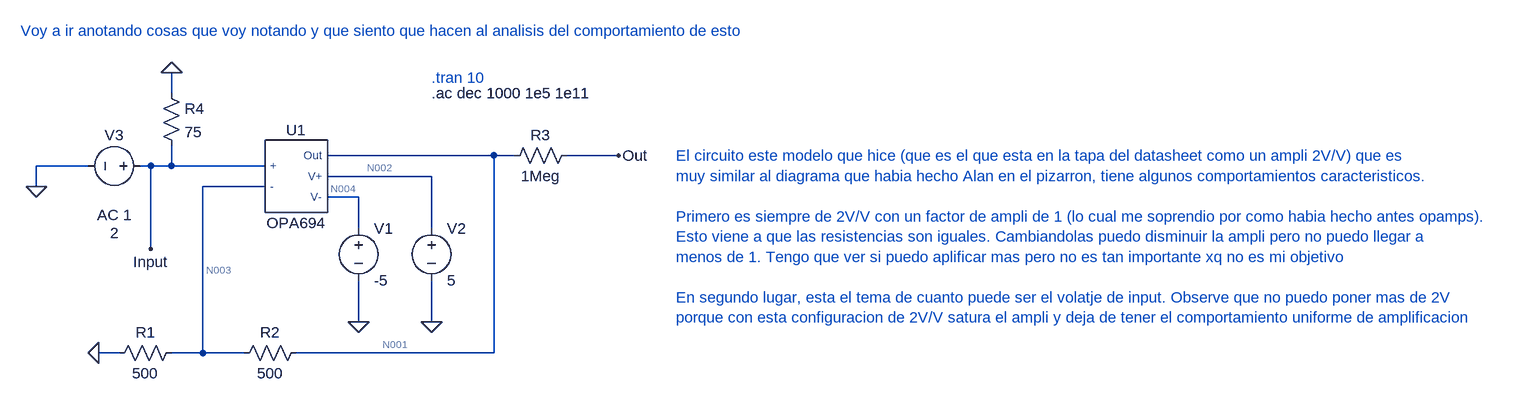
[diagram p0: schematic Draft2.asc]
Draft2.asc, the LTspice schematic file:
Version 4
SHEET 1 2036 680
WIRE -240 -192 -240 -224
WIRE 256 -96 0 -96
WIRE 288 -96 256 -96
WIRE 448 -96 368 -96
WIRE -368 -80 -448 -80
WIRE -272 -80 -288 -80
WIRE -240 -80 -240 -112
WIRE -240 -80 -272 -80
WIRE -96 -80 -240 -80
WIRE 160 -64 0 -64
WIRE -448 -48 -448 -80
WIRE -96 -48 -192 -48
WIRE 48 -32 0 -32
WIRE 48 16 48 -32
WIRE 160 16 160 -64
WIRE -272 48 -272 -80
WIRE 48 160 48 96
WIRE 160 160 160 96
WIRE -320 208 -352 208
WIRE -192 208 -192 -48
WIRE -192 208 -240 208
WIRE -128 208 -192 208
WIRE 256 208 256 -96
WIRE 256 208 -48 208
FLAG 48 160 0
FLAG 160 160 0
FLAG -448 -48 0
FLAG 448 -96 Out
FLAG -352 208 0
FLAG -240 -224 0
FLAG -272 48 Input
SYMBOL AutoGenerated\\OPA694 -48 -64 R0
SYMATTR InstName U1
SYMBOL voltage 48 0 R0
WINDOW 123 0 0 Left 0
WINDOW 39 0 0 Left 0
SYMATTR InstName V1
SYMATTR Value -5
SYMBOL res -224 192 R90
WINDOW 0 0 56 VBottom 2
WINDOW 3 32 56 VTop 2
SYMATTR InstName R1
SYMATTR Value 500
SYMBOL voltage -272 -80 R90
WINDOW 0 -32 56 VBottom 2
WINDOW 3 88 56 VTop 2
WINDOW 123 60 56 VTop 2
WINDOW 39 0 0 Left 0
SYMATTR InstName V3
SYMATTR Value 2
SYMATTR Value2 AC 1
SYMBOL res -144 224 R270
WINDOW 0 32 56 VTop 2
WINDOW 3 0 56 VBottom 2
SYMATTR InstName R2
SYMATTR Value 500
SYMBOL res 272 -80 R270
WINDOW 0 32 56 VTop 2
WINDOW 3 0 56 VBottom 2
SYMATTR InstName R3
SYMATTR Value 1Meg
SYMBOL voltage 160 0 R0
WINDOW 123 0 0 Left 0
WINDOW 39 0 0 Left 0
SYMATTR InstName V2
SYMATTR Value 5
SYMBOL res -256 -208 R0
SYMATTR InstName R4
SYMATTR Value 75
TEXT 160 -192 Left 2 !.ac dec 1000 1e5 1e11
TEXT 160 -216 Left 2 ;.tran 10
TEXT -472 -288 Left 2 ;Voy a ir anotando cosas que voy notando y que siento que hacen al analisis del comportamiento de esto
TEXT 536 -96 Left 2 ;El circuito este modelo que hice (que es el que esta en la tapa del datasheet como un ampli 2V/V) que es \nmuy similar al diagrama que habia hecho Alan en el pizarron, tiene algunos comportamientos caracteristicos.\n \nPrimero es siempre de 2V/V con un factor de ampli de 1 (lo cual me soprendio por como habia hecho antes opamps). \nEsto viene a que las resistencias son iguales. Cambiandolas puedo disminuir la ampli pero no puedo llegar a\nmenos de 1. Tengo que ver si puedo aplificar mas pero no es tan importante xq no es mi objetivo\n \nEn segundo lugar, esta el tema de cuanto puede ser el volatje de input. Observe que no puedo poner mas de 2V\nporque con esta configuracion de 2V/V satura el ampli y deja de tener el comportamiento uniforme de amplificacion

The netlist it stands for:
* Draft2.asc
XU1 Input N003 N001 N002 N004 OPA694  ; pins + - Out V+ V-
V1 N004 0 -5
R1 N003 0 500
V3 Input 0 2 AC 1
R2 N003 N001 500
R3 N001 Out 1Meg
V2 N002 0 5
R4 0 Input 75
.ac dec 1000 1e5 1e11
* .tran 10
* Voy a ir anotando cosas que voy notando y que siento que hacen al analisis del comportamiento de esto
* El circuito este modelo que hice (que es el que esta en la tapa del datasheet como un ampli 2V/V) que es
* muy similar al diagrama que habia hecho Alan en el pizarron, tiene algunos comportamientos caracteristicos.
* Primero es siempre de 2V/V con un factor de ampli de 1 (lo cual me soprendio por como habia hecho antes opamps).
* Esto viene a que las resistencias son iguales. Cambiandolas puedo disminuir la ampli pero no puedo llegar a
* menos de 1. Tengo que ver si puedo aplificar mas pero no es tan importante xq no es mi objetivo
* En segundo lugar, esta el tema de cuanto puede ser el volatje de input. Observe que no puedo poner mas de 2V
* porque con esta configuracion de 2V/V satura el ampli y deja de tener el comportamiento uniforme de amplificacion
.lib C:\Users\smili\Downloads\sboc068b\opa694.lib
.backanno
.end

* Results of the author's LTspice run, read from the files saved beside the schematic
* Operating Point, zero values left out:
*   V(n002) = 5 V
*   V(n001) = 3.981 V
*   V(input) = 2 V
*   V(n003) = 1.994 V
*   V(n004) = -5 V
*   V(out) = 3.981 V
*   I(R1) = 3.987 mA
*   I(R2) = -3.974 mA
*   I(R4) = -26.67 mA
*   I(V1) = 5.584 mA
*   I(V3) = -26.67 mA
*   I(V2) = -9.588 mA
*   Ix(u1:+) = 2.004 µA
*   Ix(u1:-) = -12.8 µA
*   Ix(u1:OUT) = -3.974 mA
*   Ix(u1:V+) = 9.588 mA
*   Ix(u1:V-) = -5.584 mA
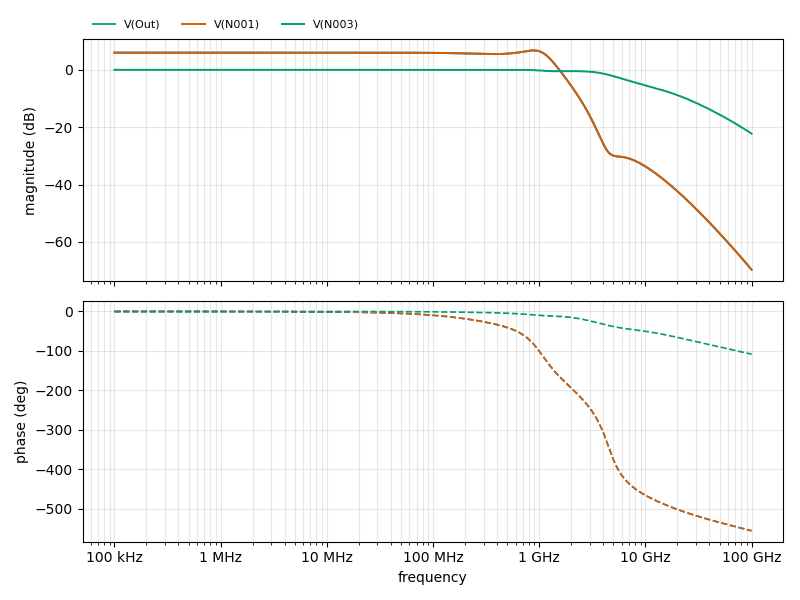
[diagram p1: AC Analysis of Draft2.asc, plotted from the saved traces]
* AC Analysis, 1 run:
*   V(Out): 5.98 dB at 100 kHz, -69.69 dB at 100 GHz, peak 6.75 dB at 887.2 MHz, 3 dB below the peak at 1.271 GHz
*   V(N001): 5.98 dB at 100 kHz, -69.69 dB at 100 GHz, peak 6.75 dB at 887.2 MHz, 3 dB below the peak at 1.271 GHz
*   V(N003): -0.02 dB at 100 kHz, -22.25 dB at 100 GHz, peak -0.02 dB at 100 kHz, 3 dB below the peak at 5.922 GHz